# Altium schematic sheet Printing6.SchDoc
size A3
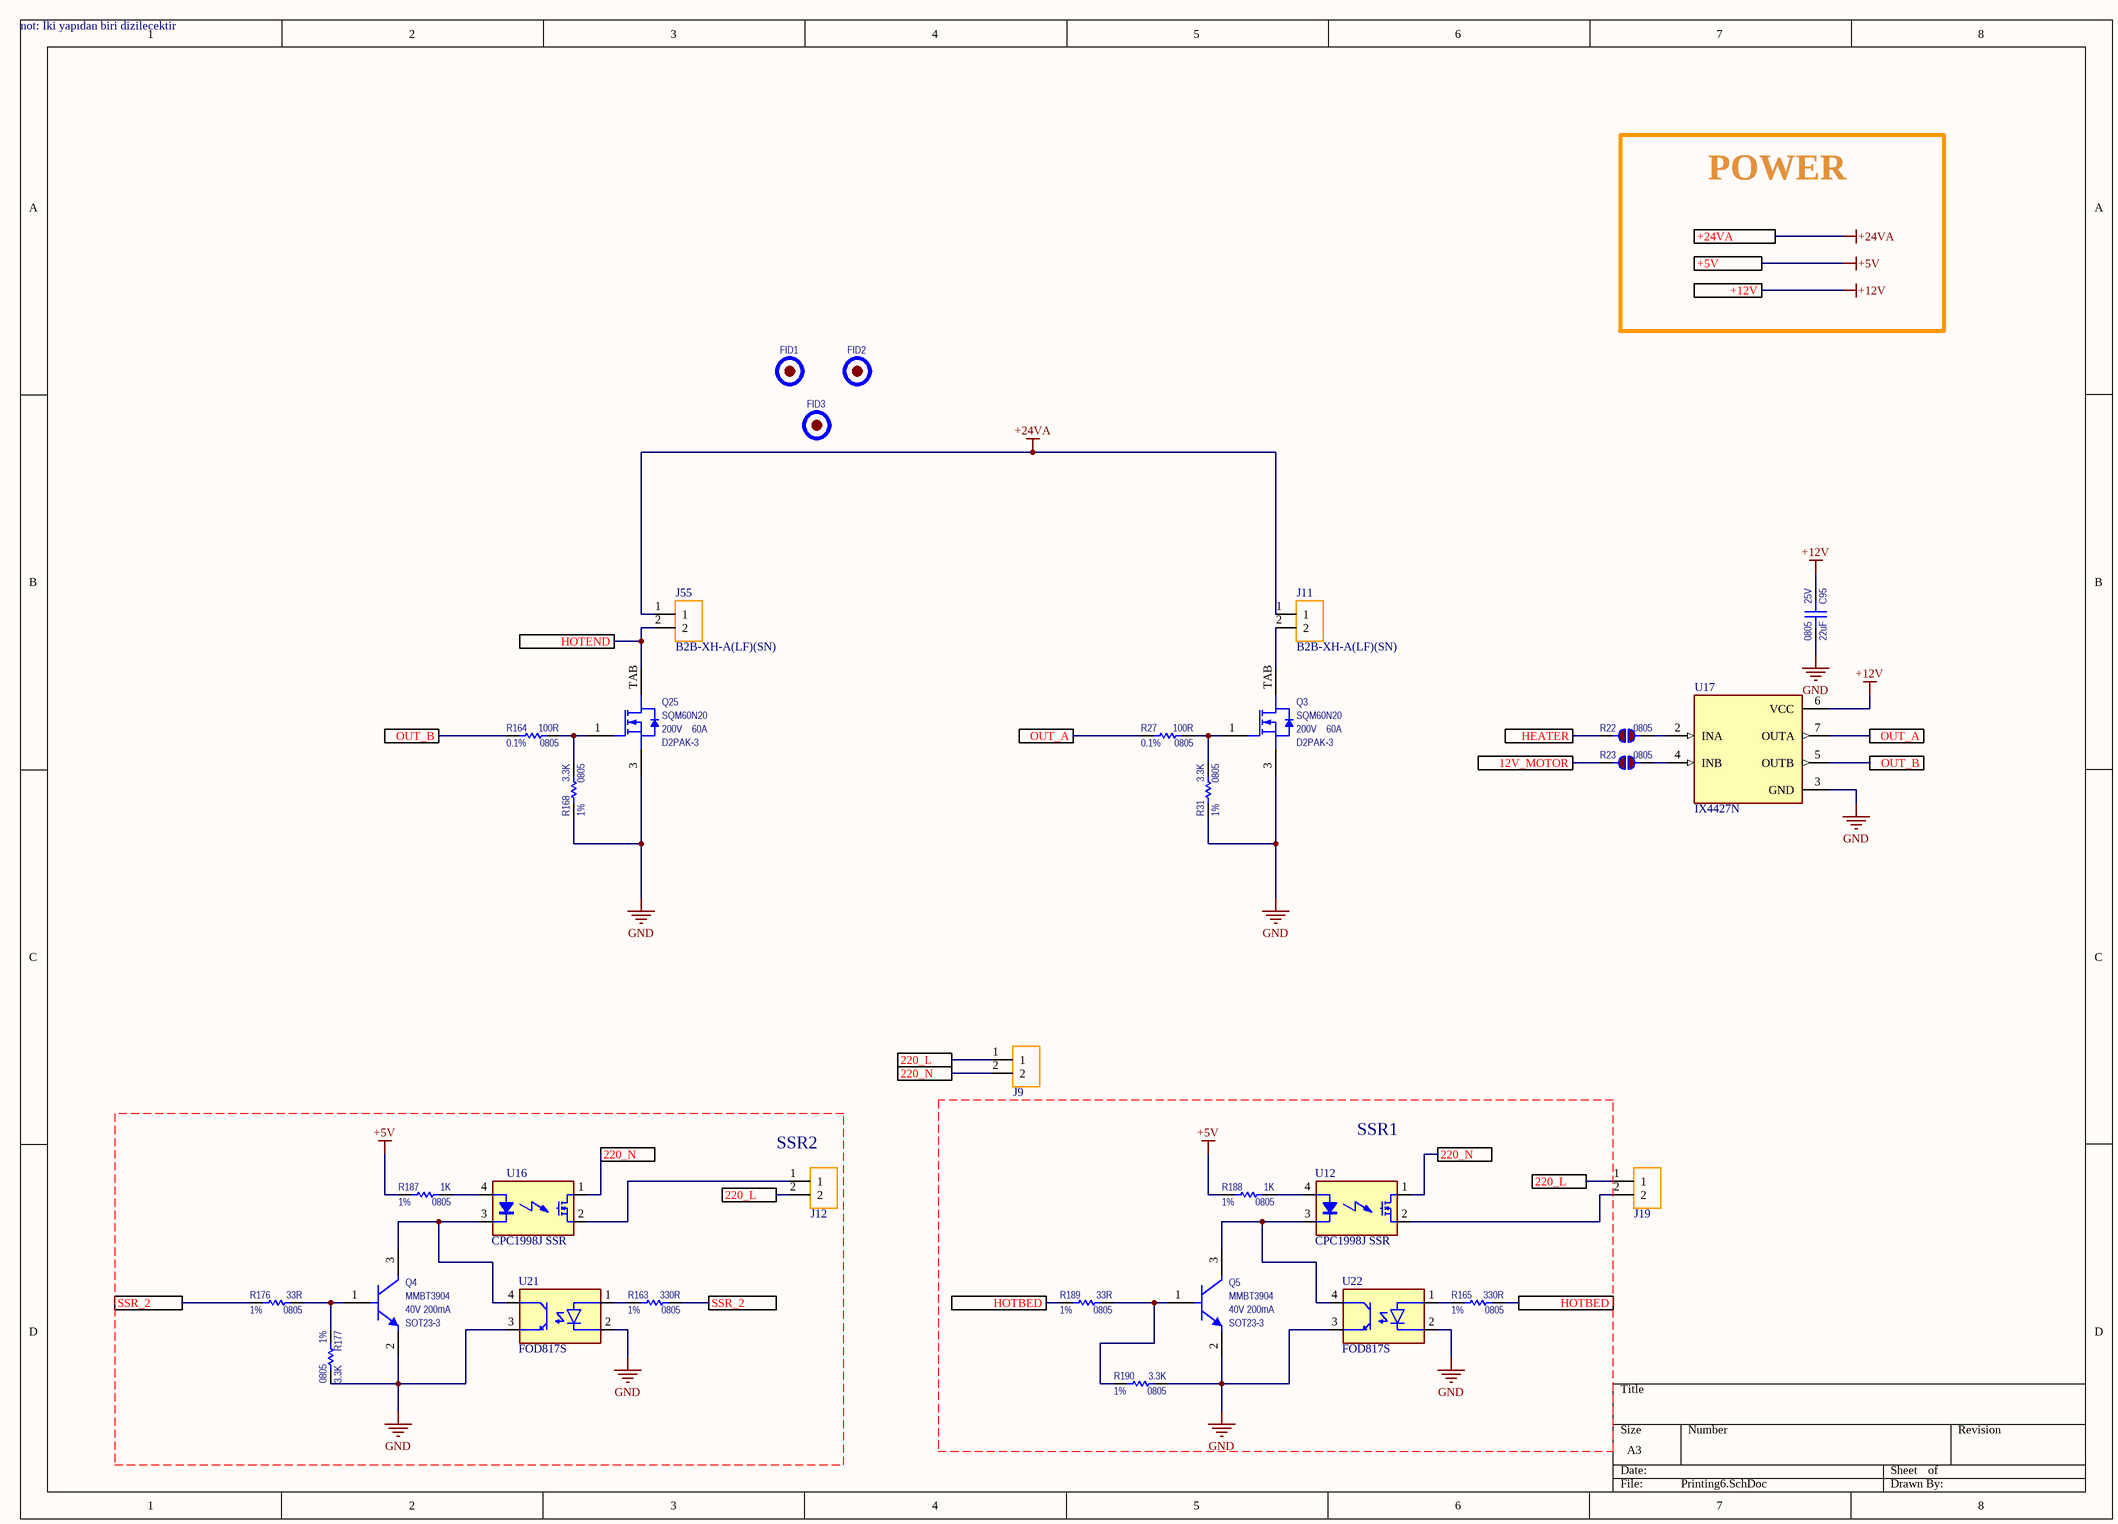
[diagram p0: Printing6.SchDoc]

## Parts
C95  value 22uF  Voltage: 25V  Package: 0805  [C_0805_GEN_1.40H]  (hidden comment: Capacitor)
FID1  Fiducial_1.00x3.00  [SMD_1.00x3.00_FID]  (value not drawn)
FID2  Fiducial_1.00x3.00  [SMD_1.00x3.00_FID]  (value not drawn)
FID3  Fiducial_1.00x3.00  [SMD_1.00x3.00_FID]  (value not drawn)
J9  5.08 Klemens  [5.08 Klemens]  (value not drawn)
J11  B2B-XH-A(LF)(SN)  [JST_B2B-XH-A(LF)(SN)]
J12  5.08 Klemens  [5.08 Klemens]  (value not drawn)
J19  5.08 Klemens  [5.08 Klemens]  (value not drawn)
J55  B2B-XH-A(LF)(SN)  [JST_B2B-XH-A(LF)(SN)]
Q3  value SQM60N20  Current: 60A  Voltage: 200V  Package: D2PAK-3  [D2PAK-3_SQM60N20-35]  (hidden comment: SingleNMOS_G1S3DTAB)
Q4  value MMBT3904  Current: 200mA  Voltage: 40V  Package: SOT23-3  [SOT23-3_MMBT3904,215]  (hidden comment: SingleNPN_B1E2C3)
Q5  value MMBT3904  Current: 200mA  Voltage: 40V  Package: SOT23-3  [SOT23-3_MMBT3904,215]  (hidden comment: SingleNPN_B1E2C3)
Q25  value SQM60N20  Current: 60A  Voltage: 200V  Package: D2PAK-3  [D2PAK-3_SQM60N20-35]  (hidden comment: SingleNMOS_G1S3DTAB)
R22  Package: 0805  [R_0805_GEN_0.70H]  (hidden comment: StandardJumper)
R23  Package: 0805  [R_0805_GEN_0.70H]  (hidden comment: StandardJumper)
R27  value 100R  Tolerance: 0.1%  Package: 0805  [R_0805_GEN_0.70H]  (hidden comment: StandardResistor)
R31  value 3.3K  Tolerance: 1%  Package: 0805  [R_0805_GEN_0.70H]  (hidden comment: StandardResistor)
R163  value 330R  Tolerance: 1%  Package: 0805  [R_0805_GEN_0.70H]  (hidden comment: StandardResistor)
R164  value 100R  Tolerance: 0.1%  Package: 0805  [R_0805_GEN_0.70H]  (hidden comment: StandardResistor)
R165  value 330R  Tolerance: 1%  Package: 0805  [R_0805_GEN_0.70H]  (hidden comment: StandardResistor)
R168  value 3.3K  Tolerance: 1%  Package: 0805  [R_0805_GEN_0.70H]  (hidden comment: StandardResistor)
R176  value 33R  Tolerance: 1%  Package: 0805  [R_0805_GEN_0.70H]  (hidden comment: StandardResistor)
R177  value 3.3K  Tolerance: 1%  Package: 0805  [R_0805_GEN_0.70H]  (hidden comment: StandardResistor)
R187  value 1K  Tolerance: 1%  Package: 0805  [R_0805_GEN_0.70H]  (hidden comment: StandardResistor)
R188  value 1K  Tolerance: 1%  Package: 0805  [R_0805_GEN_0.70H]  (hidden comment: StandardResistor)
R189  value 33R  Tolerance: 1%  Package: 0805  [R_0805_GEN_0.70H]  (hidden comment: StandardResistor)
R190  value 3.3K  Tolerance: 1%  Package: 0805  [R_0805_GEN_0.70H]  (hidden comment: StandardResistor)
U12  CPC1998J SSR  [I4-PAC]
U16  CPC1998J SSR  [I4-PAC]
U17  IX4427N  [SOIC127P600X175-8N]
U21  FOD817S  [SOIC254P1016X385-4N]
U22  FOD817S  [SOIC254P1016X385-4N]

## Ports
12V_MOTOR, 220_L, 220_N, +5V, +12V, +24VA, HEATER, HOTBED, HOTEND, OUT_A, OUT_B, SSR_2

## Nets
+5V: R187.1 R188.1 ; port +5V
+12V: C95.1 U17.6(VCC) ; port +12V
+24VA: J11.1 J55.1 ; port +24VA
GND: C95.2 Q3.3(SOURCE) Q4.2(EMITTER) Q5.2(EMITTER) Q25.3(SOURCE) R31.1 R168.1 R177.2 R190.2 U17.3(GND) U21.2(CATHODE) U21.3(EMITTER) U22.2(CATHODE) U22.3(EMITTER)
12V_MOTOR: R23.1 ; port 12V_MOTOR
220_L: J9.1 J12.2 J19.1 ; port 220_L
220_N: J9.2 U12.1(DS1) U16.1(DS1) ; port 220_N
HEATER: R22.1 ; port HEATER
HOTBED: R165.2 R189.1 ; port HOTBED
HOTEND: J55.2 Q25.TAB(DRAIN) ; port HOTEND
OUT_A: R27.1 U17.7(OUTA) ; port OUT_A
OUT_B: R164.1 U17.5(OUTB) ; port OUT_B
SSR_2: R163.2 R176.1 ; port SSR_2
NetJ11_2: J11.2 Q3.TAB(DRAIN)
NetJ12_1: J12.1 U16.2(DS2)
NetJ19_2: J19.2 U12.2(DS2)
NetQ3_1: Q3.1(GATE) R27.2 R31.2
NetQ4_1: Q4.1(BASE) R176.2 R177.1
NetQ4_3: Q4.3(COLLECTOR) U16.3(K) U21.4(COLLECTOR)
NetQ5_1: Q5.1(BASE) R189.2 R190.1
NetQ5_3: Q5.3(COLLECTOR) U12.3(K) U22.4(COLLECTOR)
NetQ25_1: Q25.1(GATE) R164.2 R168.2
NetR22_2: R22.2 U17.2(INA)
NetR23_2: R23.2 U17.4(INB)
NetR163_1: R163.1 U21.1(ANODE)
NetR165_1: R165.1 U22.1(ANODE)
NetR187_2: R187.2 U16.4(A)
NetR188_2: R188.2 U12.4(A)

## Notes on the sheet
- not: İki yapıdan biri dizilecektir
- POWER
- SSR1
- (near J12) SSR2

## Library data of the parts
C95 = CER_22uF_#6: CAP_CER_22uF_25V_X5R_20%_0805; Manufacturer#1: Murata; Manufacturer#1 PN: GRM21BR61E226ME44L; Manufacturer#2 PN: CC0805MKX5R8BB226; Similar Part: GRT21BR61E226ME13L; C2012X5R1V226M125AC; Added by: HasanA; FireANTs Code: C00159; Grade Level: Industrial; Lead Status: Pb-Free; Location: 3G15; Max Reflow Duration: 30; Max Reflow Temp: 260; Placement Area: 10.45; Power Rating: X; Temp# Operating: -55°C/+85°C; Tolerance: 20%; Identifier: CER_22uF_#6; Checked by: İlkerU; ComponentLink1Description: Resource Folder; ComponentLink1URL: C:\FireANTs_Repo\HW_Lib\trunk\ComponentLibrary\Resources\Capacitors\C00159; Cost: 0.54; Current: N/A; Failure in Time: N/A; Features: N/A; Height: 1.40; Manufacturer#2: Yageo; MSL: 1; Mounting Type: SMD; Part Status: Active; Temp# Storage: N/A; Weight: 19mg
FID1-FID3 = FID_1.00X3.00: SUP_FID_1.00x3.00_SMD; Value: X; Added by: İlhanT; Placement Area: 12.56; Package: X; Identifier: FID_1.00X3.00; FireANTs Code: X; Checked by: HasanA; ComponentLink1Description: X; ComponentLink1URL: X; Cost: X; Current: X; Failure in Time: X; Features: X; Grade Level: X; Height: 0; Lead Status: X; Location: X; Manufacturer#1: X; Manufacturer#1 PN: X; Manufacturer#2: X; Manufacturer#2 PN: X; Max Reflow Duration: X; Max Reflow Temp: X; MSL: X; Mounting Type: X; Part Status: X; Power Rating: X; Similar Part: X; Temp# Operating: X; Temp# Storage: X; Tolerance: X; Voltage: X; Weight: X
J11 J55 = B2B-XH-A(LF)(SN): Connector Header Through Hole 2 position 0.098 (2.50mm); MF: JST Sales; MP: B2B-XH-A(LF)(SN); Package: None; SnapEDA_Link: https://www.snapeda.com/parts/B2B-XH-A(LF)(SN)/JST+Sales+America+Inc./view-part/?ref=snap; Purchase-URL: https://pricing.snapeda.com/search/part/B2B-XH-A(LF)(SN)/?ref=eda; Check_prices: https://www.snapeda.com/parts/B2B-XH-A(LF)(SN)/JST+Sales+America+Inc./view-part/?ref=eda; Availability: In Stock; Value: *; Price: None
Q3 Q25 = NMOS_200V-60A_#1: TRA_NMOS_SING_200V_60A_TH3V_DPAK; Manufacturer#1: Vishay; Manufacturer#1 PN: SQM60N20-35_GE3; Similar Part: SQM10250E_GE3; Added by: İlhanT; FireANTs Code: Q00029; Failure in Time: 0.57@[60%CL; 55°C; 0.7eV]; Grade Level: Automotive; Lead Status: Pb-Free; Location: 4A8; Max Reflow Duration: 10; Max Reflow Temp: 260; Placement Area: 210.00; Power Rating: X; Temp# Operating: -55°C/+175°C; Identifier: NMOS_200V-60A_#1; Checked by: EserC; ComponentLink1Description: Resource Folder; ComponentLink1URL: C:\BNA_Repo\HW_Lib\trunk\ComponentLibrary\Resources\Transistors\Q00029; Cost: 2.86; Features: AEC-Q101;  Single nMOS; Rdson=35mR@Vgs=10V@25°C; Qgate(tot)=135nC; Vgsmax=±20V; Height: 4.83; Manufacturer#2: N/A; Manufacturer#2 PN: N/A; MSL: 1; Mounting Type: SMD; Part Status: Active; Temp# Storage: -55°C/+175°C; Tolerance: X; Weight: 1565mg
Q4 Q5 = NPN_40V-200mA_#1: TRA_NPN_SING_40V_200mA_VSAT300mV_SOT23-3; Manufacturer#1: Nexperia; Manufacturer#1 PN: MMBT3904,215; Manufacturer#2 PN: MMBT3904-7-F; Similar Part: SST3904HZGT116; PMBT3904,235; Added by: HasanA; FireANTs Code: Q00012; Failure in Time: 0.44@[60%CL; 55°C; 0.7eV]; Grade Level: Industrial; Lead Status: Pb-Free; Location: 4D3; Max Reflow Duration: 30; Max Reflow Temp: 260; Placement Area: 14.00; Power Rating: X; Temp# Operating: -65°C/+150°C; Identifier: NPN_40V-200mA_#1; Checked by: EserC; ComponentLink1Description: Resource Folder; ComponentLink1URL: C:\BNA_Repo\HW_Lib\trunk\ComponentLibrary\Resources\Transistors\Q00012; Cost: 0.10; Features: Single NPN signal BJT; Height: 1.10; Manufacturer#2: Diodes; MSL: 1; Mounting Type: SMD; Part Status: Active; Temp# Storage: -65°C/+150°C; Tolerance: X; Weight: 7.48mg
R22 R23 = STD_JUMPER_#3: RES_STD_0R_0.125W_0805; Manufacturer#1: Yageo; Manufacturer#1 PN: AC0805JR-070RL; Manufacturer#2 PN: ERJ-6GEY0R00V; Value: 0R; Added by: İlhanT; FireANTs Code: R00008; Current: X; Grade Level: Automotive; Lead Status: Pb-Free; Location: 2D2; Max Reflow Duration: 10; Max Reflow Temp: 260; Placement Area: 10.45; Power Rating: 125mW; Temp# Operating: -55°C/+155°C; Tolerance: 5%; Voltage: 150V; Identifier: STD_JUMPER_#3; Checked by: YasinY; ComponentLink1Description: Resource Folder; ComponentLink1URL: C:\FireANTs_Repo\HW_Lib\trunk\ComponentLibrary\Resources\Resistors\R00008; Cost: 0.10; Failure in Time: N/A; Features: AEC-Q200; Height: 0.70; Manufacturer#2: Panasonic; MSL: 1; Mounting Type: SMD; Part Status: Active; Similar Part: N/A; Temp# Storage: N/A; Weight: 5.5mg
R27 R164 = STD_100R_#5: RES_STD_100R_0.125W_0.1%_10ppm_0805; Manufacturer#1: Yageo; Manufacturer#1 PN: RT0805BRB07100RL; Manufacturer#2 PN: RQ73C2A100RBTD; Similar Part: RNCF0805TKY100R; RG2012N-101-W-T1; Added by: HasanA; FireANTs Code: R00072; Current: X; Grade Level: Industrial; Lead Status: Pb-Free; Location: 2D18; Max Reflow Duration: 10; Max Reflow Temp: 260; Placement Area: 10.45; Power Rating: 125mW; Temp# Operating: -55°C/+155°C; Voltage: 150V; Identifier: STD_100R_#5; Checked by: YasinY; ComponentLink1Description: Resource Folder; ComponentLink1URL: C:\FireANTs_Repo\HW_Lib\trunk\ComponentLibrary\Resources\Resistors\R00072; Cost: 0.73; Failure in Time: N/A; Features: N/A; Height: 0.70; Manufacturer#2: TE Connectivity; MSL: 1; Mounting Type: SMD; Part Status: Active; Temp# Storage: N/A; Weight: 5.5mg
R31 R168 R177 R187 R188 R190 = STD_3.3K_#3: RES_STD_3.3K_0.125W_1%_100ppm_0805; Manufacturer#1: Yageo; Manufacturer#1 PN: AC0805FR-073K3L; Manufacturer#2 PN: ERJ-6ENF3301V; Added by: HasanA; FireANTs Code: R00131; Current: X; Grade Level: Automotive; Lead Status: Pb-Free; Location: 2G8; Max Reflow Duration: 10; Max Reflow Temp: 260; Placement Area: 10.45; Power Rating: 125mW; Temp# Operating: -55°C/+155°C; Voltage: 150V; Identifier: STD_3.3K_#3; Checked by: YasinY; ComponentLink1Description: Resource Folder; ComponentLink1URL: C:\FireANTs_Repo\HW_Lib\trunk\ComponentLibrary\Resources\Resistors\R00131; Cost: 0.10; Failure in Time: N/A; Features: AEC-Q200; Height: 0.70; Manufacturer#2: Panasonic; MSL: 1; Mounting Type: SMD; Part Status: Active; Similar Part: N/A; Temp# Storage: N/A; Weight: 5.5mg
R163 R165 R176 R189 = STD_33R_#3: RES_STD_33R_0.125W_1%_100ppm_0805; Manufacturer#1: Yageo; Manufacturer#1 PN: AC0805FR-0733RL; Manufacturer#2 PN: ERJ-6ENF33R0V; Added by: HasanA; FireANTs Code: R00051; Current: X; Grade Level: Automotive; Lead Status: Pb-Free; Location: 2C13; Max Reflow Duration: 10; Max Reflow Temp: 260; Placement Area: 10.45; Power Rating: 125mW; Temp# Operating: -55°C/+155°C; Voltage: 150V; Identifier: STD_33R_#3; Checked by: YasinY; ComponentLink1Description: Resource Folder; ComponentLink1URL: C:\FireANTs_Repo\HW_Lib\trunk\ComponentLibrary\Resources\Resistors\R00051; Cost: 0.10; Failure in Time: N/A; Features: AEC-Q200; Height: 0.70; Manufacturer#2: Panasonic; MSL: 1; Mounting Type: SMD; Part Status: Active; Similar Part: N/A; Temp# Storage: N/A; Weight: 5.5mg
U12 U16 = CPC1998J
U17 = IX4427N: Low-Side Gate Driver IC Non-Inverting 8-SOIC; MF: IXYS Integrated; Value: *; MP: IX4427N; Package: SOIC-8 IXYS; Availability: Good; DigiKey-Purchase-URL: https://snapeda.com/shop?store=DigiKey&id=610744; Price: None; SnapEDA_Link: https://www.snapeda.com/parts/IX4427N/IXYS%20Integrated%20Circuits%20Division/view-part/610744/?ref=snap; Mouser-Purchase-URL: https://snapeda.com/shop?store=Mouser&id=610744; Arrow_Electronics-Purchase-URL: https://snapeda.com/shop?store=Arrow+Electronics&id=610744
U21 U22 = FOD817S: Optoisolator Transistor Output 5000Vrms 1 Channel 4-SMD; MF: ON Semiconductor; Price: None; Availability: Unavailable; Package: SMD-4 ON Semiconductor; SnapEDA_Link: https://www.snapeda.com/parts/FOD817S/ON%20Semiconductor/view-part/2890432/?ref=snap; MP: FOD817S; Value: *